# Altium project Minimum lost attenuator.PrjPcb
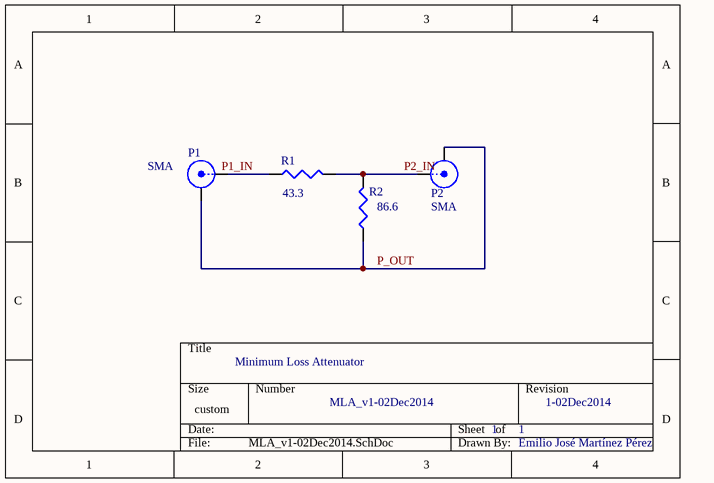
[diagram p0: MLA_v1-02Dec2014.SchDoc]
1 sheet, 4 parts. Net scope: global (net labels, ports and power ports of the same name join across sheets).
Board file: MLA_v1-02Dec2014.PcbDoc

## Sheet MLA_v1-02Dec2014.SchDoc: Minimum Loss Attenuator
size 127 x 88 mm; Engineer: Emilio José Martínez Pérez; SheetNumber: 1; SheetTotal: 1

### Parts
P1  SMA  [SMA]
P2  SMA  [SMA]
R1  value 43.3  [J1-0603]
R2  value 86.6  [J1-0603]

### Nets
P2_IN: P2.1(X) R1.2 R2.2
P_OUT: P1.2(Y) P2.2(Y) R2.1
NetP1_1: P1.1(X) R1.1

### Notes on the sheet
- Minimum Loss Attenuator
- MLA_v1-02Dec2014
- 1
- 1-02Dec2014
- Emilio José Martínez Pérez
- Labels drawn without touching a wire or pin: P1_IN

### Library data of the parts
R1 R2 = Res3: Resistor; Published: 8-Jun-2000; LatestRevisionDate: 29-May-2009; LatestRevisionNote: IPC-7351 Footprint Added.; PackageReference: J1-0603; Publisher: Altium Limited; PackageDescription: Chip Resistor
P1 P2 = SMA: LatestRevisionDate: 17-Jul-2002; LatestRevisionNote: Re-released for DXP Platform.; Publisher: Altium Limited